# EAGLE design Hall_Sensor (EAGLE 8.2.2)
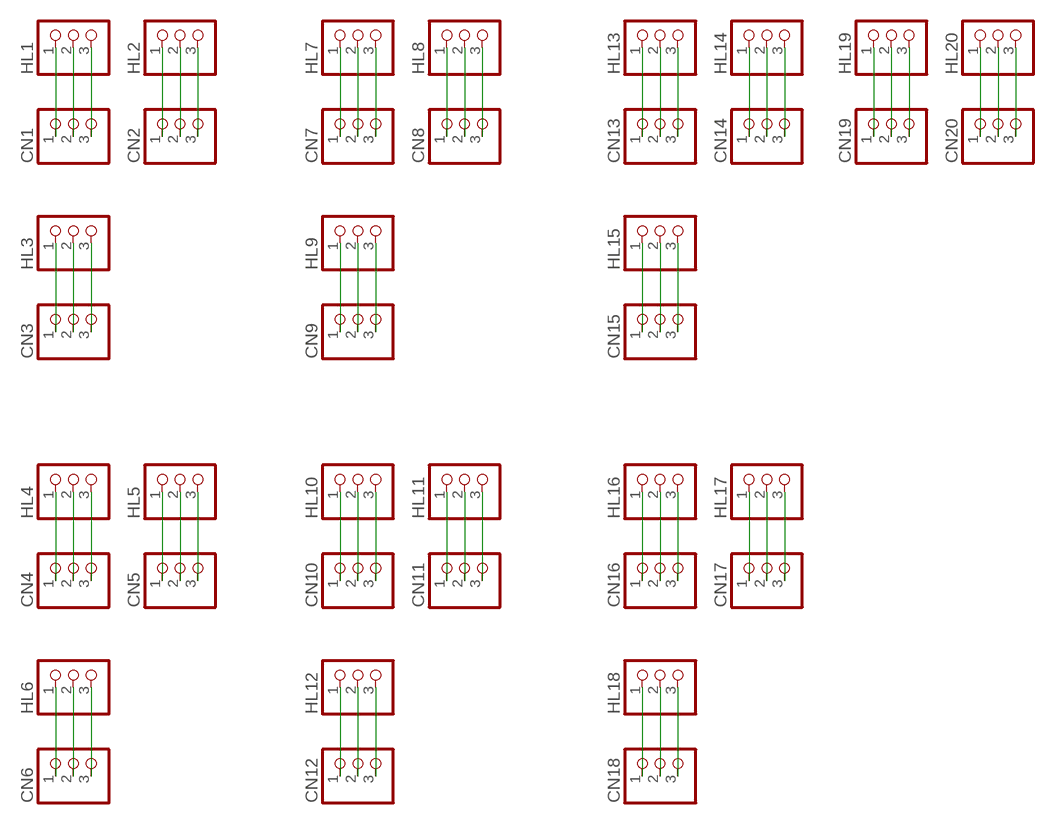
[diagram p0: schematic, sheet 1]

## Parts
CN1  PINHD-1X3  [1X03]
CN2  PINHD-1X3  [1X03]
CN3  PINHD-1X3  [1X03]
CN4  PINHD-1X3  [1X03]
CN5  PINHD-1X3  [1X03]
CN6  PINHD-1X3  [1X03]
CN7  PINHD-1X3  [1X03]
CN8  PINHD-1X3  [1X03]
CN9  PINHD-1X3  [1X03]
CN10  PINHD-1X3  [1X03]
CN11  PINHD-1X3  [1X03]
CN12  PINHD-1X3  [1X03]
CN13  PINHD-1X3  [1X03]
CN14  PINHD-1X3  [1X03]
CN15  PINHD-1X3  [1X03]
CN16  PINHD-1X3  [1X03]
CN17  PINHD-1X3  [1X03]
CN18  PINHD-1X3  [1X03]
CN19  PINHD-1X3  [1X03]
CN20  PINHD-1X3  [1X03]
HL1  PINHD-1X3  [1X03]
HL2  PINHD-1X3  [1X03]
HL3  PINHD-1X3  [1X03]
HL4  PINHD-1X3  [1X03]
HL5  PINHD-1X3  [1X03]
HL6  PINHD-1X3  [1X03]
HL7  PINHD-1X3  [1X03]
HL8  PINHD-1X3  [1X03]
HL9  PINHD-1X3  [1X03]
HL10  PINHD-1X3  [1X03]
HL11  PINHD-1X3  [1X03]
HL12  PINHD-1X3  [1X03]
HL13  PINHD-1X3  [1X03]
HL14  PINHD-1X3  [1X03]
HL15  PINHD-1X3  [1X03]
HL16  PINHD-1X3  [1X03]
HL17  PINHD-1X3  [1X03]
HL18  PINHD-1X3  [1X03]
HL19  PINHD-1X3  [1X03]
HL20  PINHD-1X3  [1X03]

## Nets
N$1: CN7.1 HL7.1
N$2: CN7.2 HL7.2
N$3: CN7.3 HL7.3
N$4: CN8.1 HL8.1
N$5: CN8.2 HL8.2
N$6: CN8.3 HL8.3
N$7: CN9.1 HL9.1
N$8: CN9.2 HL9.2
N$9: CN9.3 HL9.3
N$10: CN10.1 HL10.1
N$11: CN10.2 HL10.2
N$12: CN10.3 HL10.3
N$13: CN11.1 HL11.1
N$14: CN11.2 HL11.2
N$15: CN11.3 HL11.3
N$16: CN12.1 HL12.1
N$17: CN12.2 HL12.2
N$18: CN12.3 HL12.3
N$19: CN13.1 HL13.1
N$20: CN13.2 HL13.2
N$21: CN13.3 HL13.3
N$22: CN14.1 HL14.1
N$23: CN14.2 HL14.2
N$24: CN14.3 HL14.3
N$25: CN15.1 HL15.1
N$26: CN15.2 HL15.2
N$27: CN15.3 HL15.3
N$28: CN16.1 HL16.1
N$29: CN16.2 HL16.2
N$30: CN16.3 HL16.3
N$31: CN17.1 HL17.1
N$32: CN17.2 HL17.2
N$33: CN17.3 HL17.3
N$34: CN18.1 HL18.1
N$35: CN18.2 HL18.2
N$36: CN18.3 HL18.3
N$37: CN19.1 HL19.1
N$38: CN19.2 HL19.2
N$39: CN19.3 HL19.3
N$40: CN1.1 HL1.1
N$41: CN20.1 HL20.1
N$42: CN20.2 HL20.2
N$43: CN20.3 HL20.3
N$44: CN1.2 HL1.2
N$45: CN1.3 HL1.3
N$47: CN2.1 HL2.1
N$48: CN2.2 HL2.2
N$51: CN2.3 HL2.3
N$53: CN3.1 HL3.1
N$54: CN3.2 HL3.2
N$55: CN3.3 HL3.3
N$56: CN4.1 HL4.1
N$57: CN4.2 HL4.2
N$59: CN4.3 HL4.3
N$60: CN5.1 HL5.1
N$61: CN5.2 HL5.2
N$62: CN5.3 HL5.3
N$63: CN6.1 HL6.1
N$64: CN6.2 HL6.2
N$65: CN6.3 HL6.3

## Library data of the parts
CN1-CN20 HL1-HL20 = pinhead:PINHD-1X3: PIN HEADER

## Net classes
0 default: width 1.016 mm, clearance 0.254 mm

## Board
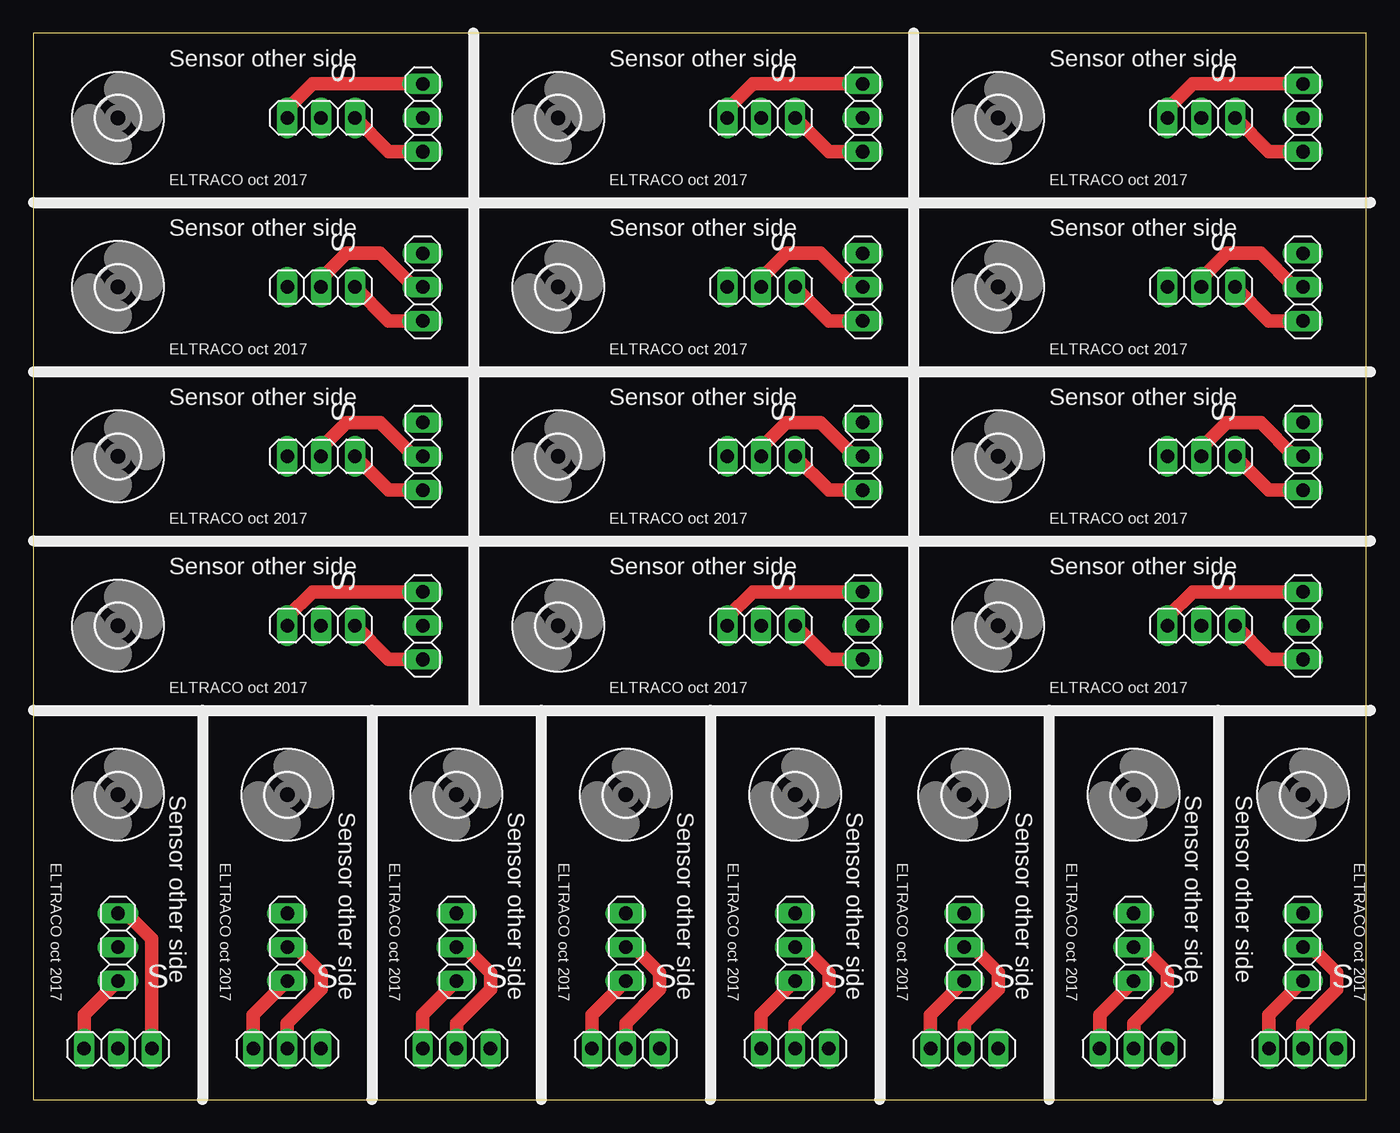
[diagram p1: board, top side]
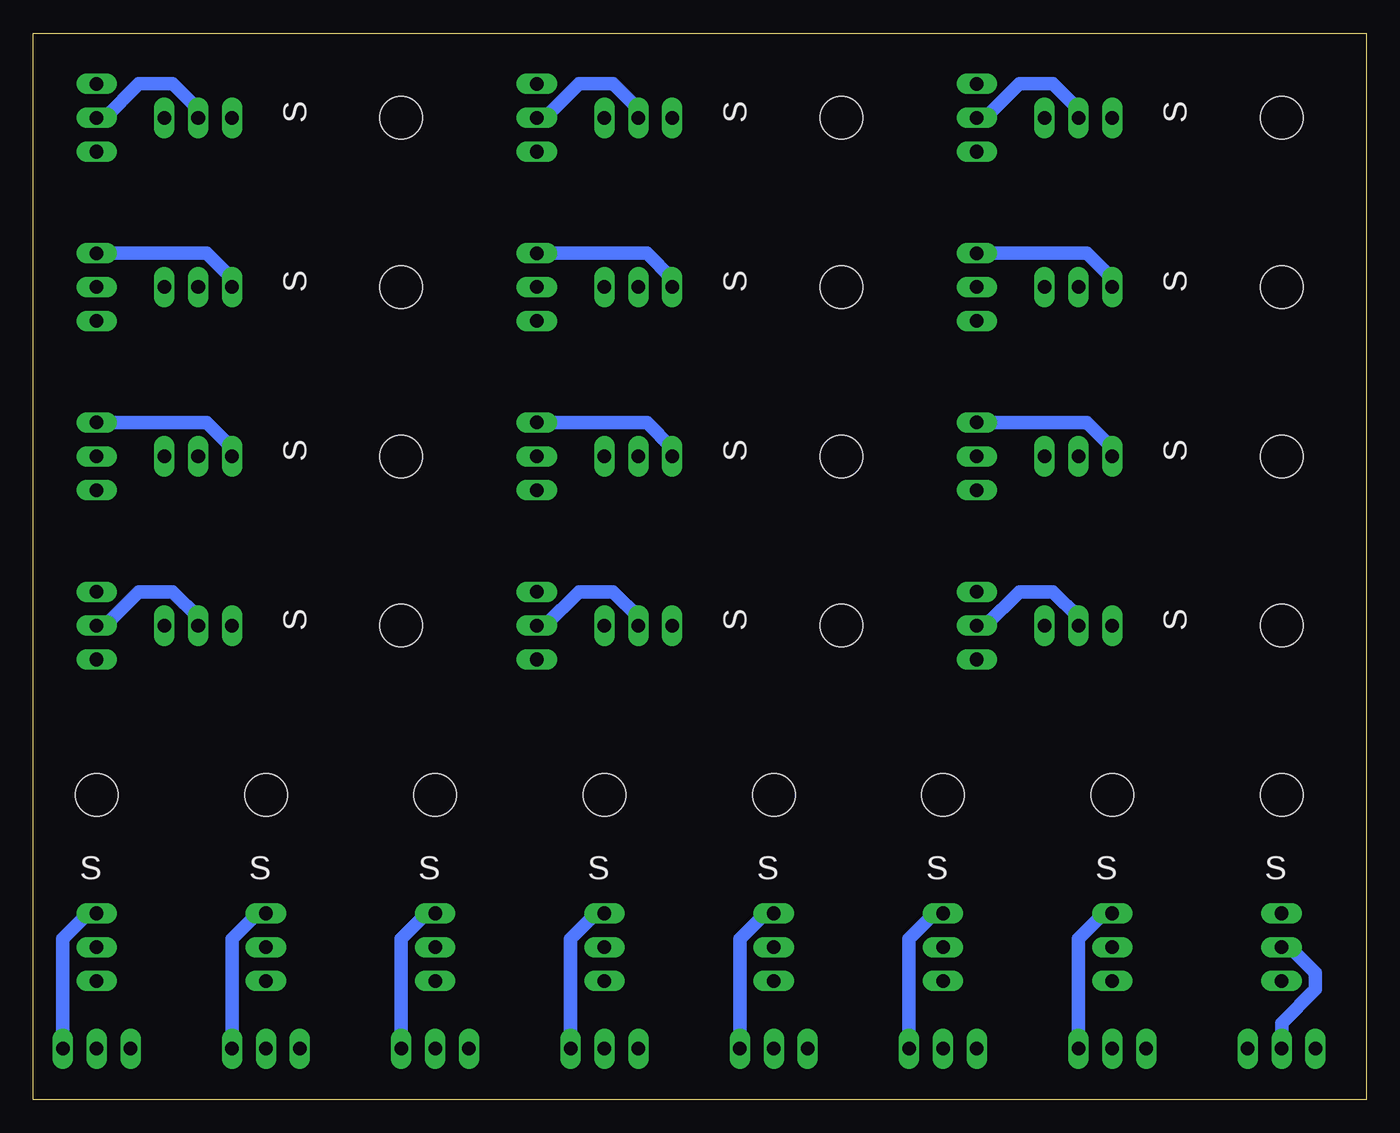
[diagram p2: board, bottom side, seen from below]

Size 100 x 80 mm. Coordinates in mm from the lower left corner, seen from the top.
Outline: 0,0 100,0 100,80 0,80 0,0
Copper layers (1*16): Top 0.035mm / dielectric 1.5mm / Bottom 0.035mm
Design rules "default": minimum track width 6mil, minimum drill 0.35mm, track to track 6mil, track to pad 6mil, pad to pad 6mil, via to via 6mil, smd to smd 6mil, copper to edge 40mil, drill to drill 6mil, minimum pad ring 10mil, minimum via ring 8mil, stop-mask expansion 4mil, vias tented up to drill 0mil, thermal gap 10mil

### Footprints (pad centres in the part's own frame; a part is rotated, then mirrored left to right if it is on the bottom)
1X03 = drill 1.016 long: 1 -2.54,0; 2 0,0; 3 2.54,0
3,2 = hole 3.2: 0,0

### Placement (x,y rotation side)
CN1  29.21,73.66 90 top
CN2  62.23,73.66 90 top
CN3  95.25,73.66 90 top
CN4  29.21,60.96 90 top
CN5  62.23,60.96 90 top
CN6  95.25,60.96 90 top
CN7  29.21,48.26 90 top
CN8  62.23,48.26 90 top
CN9  95.25,48.26 90 top
CN10  29.21,35.56 90 top
CN11  62.23,35.56 90 top
CN12  95.25,35.56 90 top
CN13  6.35,3.81 0 top
CN14  19.05,3.81 0 top
CN15  31.75,3.81 0 top
CN16  44.45,3.81 0 top
CN17  57.15,3.81 0 top
CN18  69.85,3.81 0 top
CN19  82.55,3.81 0 top
CN20  95.25,3.81 0 top
HL1  21.59,73.66 180 top
HL2  54.61,73.66 180 top
HL3  87.63,73.66 180 top
HL4  21.59,60.96 180 top
HL5  54.61,60.96 180 top
HL6  87.63,60.96 180 top
HL7  21.59,48.26 180 top
HL8  54.61,48.26 180 top
HL9  87.63,48.26 180 top
HL10  21.59,35.56 180 top
HL11  54.61,35.56 180 top
HL12  87.63,35.56 180 top
HL13  6.35,11.43 90 top
HL14  19.05,11.43 90 top
HL15  31.75,11.43 90 top
HL16  44.45,11.43 90 top
HL17  57.15,11.43 90 top
HL18  69.85,11.43 90 top
HL19  82.55,11.43 90 top
HL20  95.25,11.43 90 top
U$1  [3,2]  6.35,73.66 0 top
U$2  [3,2]  39.37,73.66 0 top
U$3  [3,2]  72.39,73.66 0 top
U$4  [3,2]  72.39,60.96 0 top
U$5  [3,2]  39.37,60.96 0 top
U$6  [3,2]  6.35,60.96 0 top
U$7  [3,2]  6.35,48.26 0 top
U$8  [3,2]  6.35,35.56 0 top
U$9  [3,2]  39.37,35.56 0 top
U$10  [3,2]  39.37,48.26 0 top
U$11  [3,2]  72.39,48.26 0 top
U$12  [3,2]  72.39,35.56 0 top
U$13  [3,2]  6.35,22.86 0 top
U$14  [3,2]  19.05,22.86 0 top
U$15  [3,2]  31.75,22.86 0 top
U$16  [3,2]  44.45,22.86 0 top
U$17  [3,2]  57.15,22.86 0 top
U$18  [3,2]  69.85,22.86 0 top
U$19  [3,2]  82.55,22.86 0 top
U$20  [3,2]  95.25,22.86 0 top

### Tracks (layer width: path | path; a pad name or v marks a point on that pad's centre or on a via)
N$1
  Top 1.016: CN7.1 26.67,45.72 HL7.1
N$2
  Top 1.016: HL7.2 21.59,48.9 23.5,50.8 26.04,50.8 28.57,48.26 CN7.2
N$3
  Bottom 1.016: HL7.3 19.05,48.9 20.95,50.8 CN7.3
N$4
  Top 1.016: CN8.1 59.69,45.72 HL8.1
N$5
  Top 1.016: HL8.2 54.61,48.9 56.52,50.8 59.05,50.8 61.59,48.26 CN8.2
N$6
  Bottom 1.016: HL8.3 52.07,48.9 53.98,50.8 CN8.3
N$7
  Top 1.016: CN9.1 92.71,45.72 HL9.1
N$8
  Top 1.016: HL9.2 87.63,48.9 89.53,50.8 92.08,50.8 94.61,48.26 CN9.2
N$9
  Bottom 1.016: HL9.3 85.09,48.9 87,50.8 CN9.3
N$10
  Top 1.016: CN10.1 26.67,33.02 HL10.1
N$11
  Bottom 1.016: HL10.2 21.59,36.2 23.5,38.1 26.04,38.1 28.57,35.56 CN10.2
N$12
  Top 1.016: HL10.3 19.05,36.2 20.95,38.1 CN10.3
N$13
  Top 1.016: CN11.1 59.69,33.02 HL11.1
N$14
  Bottom 1.016: HL11.2 54.61,36.2 56.52,38.1 59.05,38.1 61.59,35.56 CN11.2
N$15
  Top 1.016: HL11.3 52.07,36.2 53.98,38.1 CN11.3
N$16
  Top 1.016: CN12.1 92.71,33.02 HL12.1
N$17
  Bottom 1.016: HL12.2 87.63,36.2 89.53,38.1 92.08,38.1 94.61,35.56 CN12.2
N$18
  Top 1.016: HL12.3 85.09,36.2 87,38.1 CN12.3
N$19
  Top 1.016: CN13.1 3.81,6.35 HL13.1
N$20
  Bottom 1.016: CN13.2 6.35,5.71 3.81,8.26 3.81,9.53 5.71,11.43 HL13.2
N$21
  Top 1.016: HL13.3 6.99,13.97 8.89,12.06 CN13.3
N$22
  Top 1.016: CN14.1 16.51,6.35 HL14.1
N$23
  Top 1.016: CN14.2 19.05,5.71 21.59,8.26 21.59,9.53 19.68,11.43 HL14.2
N$24
  Bottom 1.016: HL14.3 19.68,13.97 21.59,12.06 CN14.3
N$25
  Top 1.016: CN15.1 29.21,6.35 HL15.1
N$26
  Top 1.016: CN15.2 31.75,5.71 34.29,8.26 34.29,9.53 32.38,11.43 HL15.2
N$27
  Bottom 1.016: HL15.3 32.38,13.97 34.29,12.06 CN15.3
N$28
  Top 1.016: CN16.1 41.91,6.35 HL16.1
N$29
  Top 1.016: CN16.2 44.45,5.71 46.99,8.26 46.99,9.53 45.09,11.43 HL16.2
N$30
  Bottom 1.016: HL16.3 45.09,13.97 46.99,12.06 CN16.3
N$31
  Top 1.016: CN17.1 54.61,6.35 HL17.1
N$32
  Top 1.016: CN17.2 57.15,5.71 59.69,8.26 59.69,9.53 57.78,11.43 HL17.2
N$33
  Bottom 1.016: HL17.3 57.78,13.97 59.69,12.06 CN17.3
N$34
  Top 1.016: CN18.1 67.31,6.35 HL18.1
N$35
  Top 1.016: CN18.2 69.85,5.71 72.39,8.26 72.39,9.53 70.48,11.43 HL18.2
N$36
  Bottom 1.016: HL18.3 70.48,13.97 72.39,12.06 CN18.3
N$37
  Top 1.016: CN19.1 80.01,6.35 HL19.1
N$38
  Top 1.016: CN19.2 82.55,5.71 85.09,8.26 85.09,9.53 83.19,11.43 HL19.2
N$39
  Bottom 1.016: HL19.3 83.19,13.97 85.09,12.06 CN19.3
N$40
  Top 1.016: CN1.1 26.67,71.12 HL1.1
N$41
  Top 1.016: CN20.1 92.71,6.35 HL20.1
N$42
  Top 1.016: CN20.2 95.25,5.71 97.79,8.26 97.79,9.53 95.89,11.43 HL20.2
N$43
  Bottom 1.016: HL20.3 95.89,13.97 97.79,12.06 CN20.3
N$44
  Bottom 1.016: HL1.2 21.59,74.3 23.5,76.2 26.04,76.2 28.57,73.66 CN1.2
N$45
  Top 1.016: HL1.3 19.05,74.3 20.95,76.2 CN1.3
N$47
  Top 1.016: CN2.1 59.69,71.12 HL2.1
N$48
  Bottom 1.016: HL2.2 54.61,74.3 56.52,76.2 59.05,76.2 61.59,73.66 CN2.2
N$51
  Top 1.016: HL2.3 52.07,74.3 53.98,76.2 CN2.3
N$53
  Top 1.016: CN3.1 92.71,71.12 HL3.1
N$54
  Bottom 1.016: HL3.2 87.63,74.3 89.53,76.2 92.08,76.2 94.61,73.66 CN3.2
N$55
  Top 1.016: HL3.3 85.09,74.3 87,76.2 CN3.3
N$56
  Top 1.016: CN4.1 26.67,58.42 HL4.1
N$57
  Top 1.016: HL4.2 21.59,61.59 23.5,63.5 26.04,63.5 28.57,60.96 CN4.2
N$59
  Bottom 1.016: HL4.3 19.05,61.59 20.95,63.5 CN4.3
N$60
  Top 1.016: CN5.1 59.69,58.42 HL5.1
N$61
  Top 1.016: HL5.2 54.61,61.59 56.52,63.5 59.05,63.5 61.59,60.96 CN5.2
N$62
  Bottom 1.016: HL5.3 52.07,61.59 53.98,63.5 CN5.3
N$63
  Top 1.016: CN6.1 92.71,58.42 HL6.1
N$64
  Top 1.016: HL6.2 87.63,61.59 89.53,63.5 92.08,63.5 94.61,60.96 CN6.2
N$65
  Bottom 1.016: HL6.3 85.09,61.59 87,63.5 CN6.3

### Text on the board
tNames: Sensor other side | Sensor other side | Sensor other side | S | S | S | ELTRACO oct 2017 | ELTRACO oct 2017 | ELTRACO oct 2017 | Sensor other side | Sensor other side | Sensor other side | S | S | S | ELTRACO oct 2017 | ELTRACO oct 2017 | ELTRACO oct 2017 | Sensor other side | Sensor other side | Sensor other side | S | S | S | ELTRACO oct 2017 | ELTRACO oct 2017 | ELTRACO oct 2017 | Sensor other side | Sensor other side | Sensor other side | S | S | S | ELTRACO oct 2017 | ELTRACO oct 2017 | ELTRACO oct 2017 | Sensor other side | Sensor other side | Sensor other side | Sensor other side | Sensor other side | Sensor other side | Sensor other side | Sensor other side | ELTRACO oct 2017 | ELTRACO oct 2017 | ELTRACO oct 2017 | ELTRACO oct 2017 | ELTRACO oct 2017 | ELTRACO oct 2017 | ELTRACO oct 2017 | ELTRACO oct 2017 | S | S | S | S | S | S | S | S
bNames: S | S | S | S | S | S | S | S | S | S | S | S | S | S | S | S | S | S | S | S